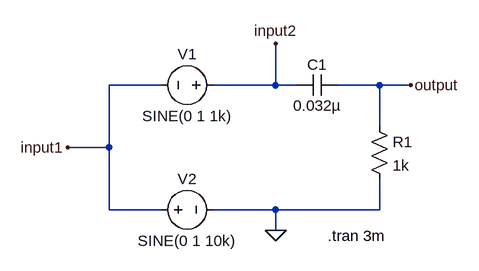
[diagram p0: schematic high-pass-analysis.asc]
high-pass-analysis.asc, the LTspice schematic file:
Version 4
SHEET 1 880 680
WIRE 48 80 -32 80
WIRE 224 80 224 16
WIRE 224 80 128 80
WIRE 256 80 224 80
WIRE 384 80 320 80
WIRE 432 80 384 80
WIRE 384 144 384 80
WIRE -32 176 -32 80
WIRE -32 176 -96 176
WIRE -32 272 -32 176
WIRE 48 272 -32 272
WIRE 224 272 128 272
WIRE 384 272 384 224
WIRE 384 272 224 272
WIRE 224 304 224 272
FLAG 224 304 0
FLAG 432 80 output
FLAG -96 176 input1
FLAG 224 16 input2
SYMBOL cap 320 64 R90
WINDOW 0 0 32 VBottom 2
WINDOW 3 32 32 VTop 2
SYMATTR InstName C1
SYMATTR Value 0.032µ
SYMBOL res 368 128 R0
SYMATTR InstName R1
SYMATTR Value 1k
SYMBOL voltage 144 80 R90
WINDOW 0 -32 56 VBottom 2
WINDOW 3 32 56 VTop 2
WINDOW 123 0 0 Left 0
WINDOW 39 0 0 Left 0
SYMATTR InstName V1
SYMATTR Value SINE(0 1 1k)
SYMBOL voltage 32 272 R270
WINDOW 0 32 56 VTop 2
WINDOW 3 -32 56 VBottom 2
WINDOW 123 0 0 Left 0
WINDOW 39 0 0 Left 0
SYMATTR InstName V2
SYMATTR Value SINE(0 1 10k)
TEXT 304 312 Left 2 !.tran 3m

The netlist it stands for:
* high-pass-analysis.asc
C1 output input2 0.032µ
R1 output 0 1k
V1 input2 input1 SINE(0 1 1k)
V2 input1 0 SINE(0 1 10k)
.tran 3m
.backanno
.end

* Results of the author's LTspice run, read from the files saved beside the schematic
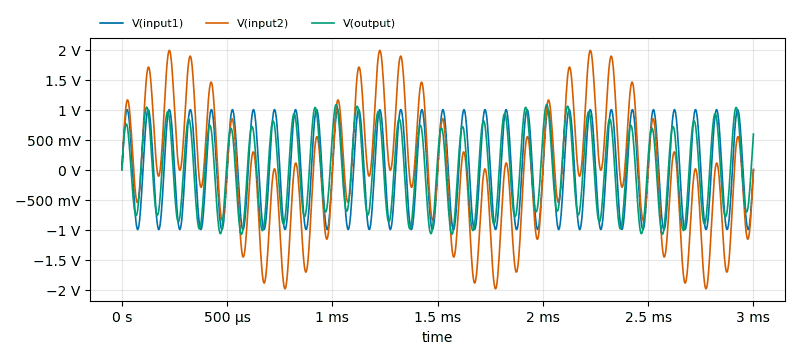
[diagram p1: Transient Analysis of high-pass-analysis.asc, plotted from the saved traces]
* Transient Analysis, 1 run:
*   V(input1): min -1 V, max 1 V, average 1.281 µV, rms 707.4 mV, last 0 V
*   V(input2): min -1.987 V, max 1.987 V, average 1.271 µV, rms 1 V, last 0 V
*   V(output): min -1.08 V, max 1.083 V, average -6.31 mV, rms 639.8 mV, last 591.3 mV